# Altium schematic sheet Band_Pass.SchDoc
size 381 x 254 mm
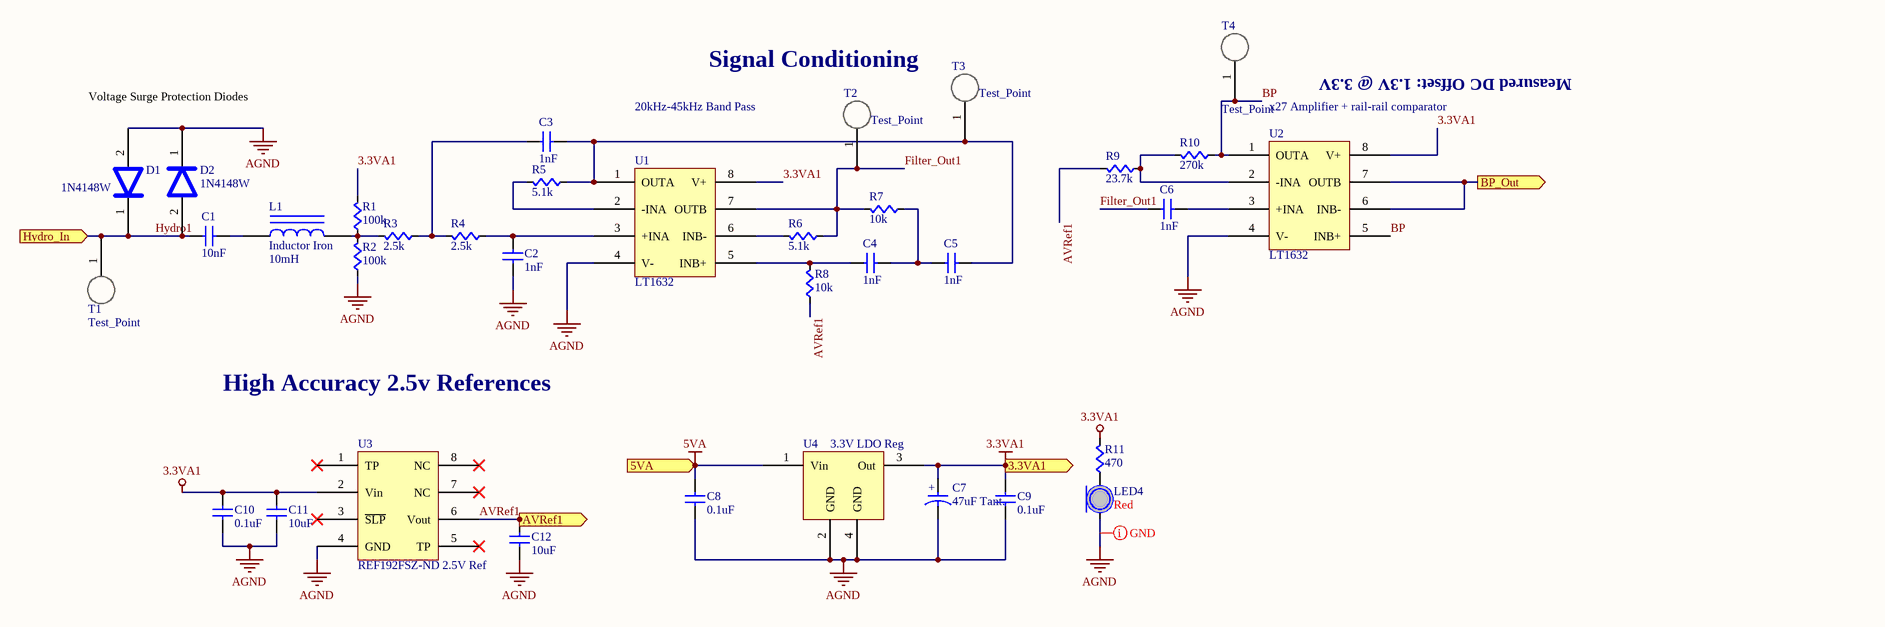
[diagram p0: Band_Pass.SchDoc]

## Parts
C1  value 10nF  [CAPC0603]  (hidden comment: Cap)
C2  value 1nF  [CAPC0603]  (hidden comment: Cap)
C3  value 1nF  [CAPC0603]  (hidden comment: Cap)
C4  value 1nF  [CAPC0603]  (hidden comment: Cap)
C5  value 1nF  [CAPC0603]  (hidden comment: Cap)
C6  value 1nF  [CAPC0603]  (hidden comment: Cap)
C7  value 47uF Tant.  [1206]  (hidden comment: Cap Tant)
C8  value 0.1uF  [CAPC0603]  (hidden comment: Cap)
C9  value 0.1uF  [CAPC0603]  (hidden comment: Cap)
C10  value 0.1uF  [CAPC0603]  (hidden comment: Cap)
C11  value 10uF  [CAPC0603]  (hidden comment: Cap)
C12  value 10uF  [CAPC0603]  (hidden comment: Cap)
D1  1N4148W  [SOD-123]
D2  1N4148W  [SOD-123]
L1  Inductor Iron  value 10mH  [Axial-11.7]
LED4  Color: Red  [LED0805]  (hidden comment: LED)
R1  value 100k  [RES0603]  (hidden comment: Res)
R2  value 100k  [RES0603]  (hidden comment: Res)
R3  value 2.5k  [RES0603]  (hidden comment: Res)
R4  value 2.5k  [RES0603]  (hidden comment: Res)
R5  value 5.1k  [RES0603]  (hidden comment: Res)
R6  value 5.1k  [RES0603]  (hidden comment: Res)
R7  value 10k  [RES0603]  (hidden comment: Res)
R8  value 10k  [RES0603]  (hidden comment: Res)
R9  value 23.7k  [RES0603]  (hidden comment: Res)
R10  value 270k  [RES0603]  (hidden comment: Res)
R11  value 470  [RES0603]  (hidden comment: Res)
T1  Test_Point  [TP]
T2  Test_Point  [TP]
T3  Test_Point  [TP]
T4  Test_Point  [TP]
U1  LT1632  [SOIC127P600-8N]
U2  LT1632  [SOIC127P600-8N]
U3  REF192FSZ-ND 2.5V Ref  [SOIC2.5-8n]
U4  3.3V LDO Reg  [SOT23-4n]

## Ports
3.3VA1 (out), 5VA (in), AVRef1 (out), BP_Out (out), Hydro_In (in)

## Nets
3.3VA1: C7.1(A) C9.1(A) C10.1(A) C11.1(A) R1.1(A) R11.1(A) U1.8(V+) U2.8(V+) U3.2(Vin) U4.3(Out) ; port 3.3VA1
5VA: C8.1(A) U4.1(Vin) ; port 5VA
AGND: C2.2(B) C7.2(B) C8.2(B) C9.2(B) C10.2(B) C11.2(B) C12.2(B) D1.2 D2.1 LED4.C R2.2(B) U1.4(V-) U2.4(V-) U3.4(GND) U4.2(GND) U4.4(GND)
AVRef1: C12.1(A) R8.2(B) R9.1(A) U3.6(Vout) ; port AVRef1
BP: R10.2(B) T4.1 U2.1(OUTA) U2.5(INB+)
BP_Out: U2.6(INB-) U2.7(OUTB) ; port BP_Out
Filter_Out1: C6.1(A) R6.2(B) R7.1(A) T2.1 U1.7(OUTB)
Hydro1: C1.1(A) D1.1 D2.2 T1.1 ; port Hydro_In
NetC1_2: C1.2(B) L1.1
NetC2_1: C2.1(A) R4.2(B) U1.3(+INA)
NetC3_1: C3.1(A) R3.2(B) R4.1(A)
NetC3_2: C3.2(B) C5.2(B) R5.2(B) T3.1 U1.1(OUTA)
NetC4_1: C4.1(A) R8.1(A) U1.5(INB+)
NetC4_2: C4.2(B) C5.1(A) R7.2(B)
NetC6_2: C6.2(B) U2.3(+INA)
NetL1_2: L1.2 R1.2(B) R2.1(A) R3.1(A)
NetLED4_A: LED4.A R11.2(B)
NetR5_1: R5.1(A) U1.2(-INA)
NetR6_1: R6.1(A) U1.6(INB-)
NetR9_2: R9.2(B) R10.1(A) U2.2(-INA)

Not connected (* = marked no-connect by the designer): U3 1(TP)* 3(~{SLP})* 5(TP)* 7(NC)* 8(NC)*

## Layout directives
net class Ground: AGND

## Notes on the sheet
- Voltage Surge Protection Diodes
- 20kHz-45kHz Band Pass
- Signal Conditioning
- x27 Amplifier + rail-rail comparator
- Measured DC Offset: 1.3V @ 3.3V
- High Accuracy 2.5v References
- (in symbol CapPol) +

## Library data of the parts
C7 = CapPol: CAP TANT 47UF 10V 10% 1411; Supplier 1: Digi-Key; Supplier Part Number 1: 399-9728-1-ND
D1 D2 = 1N4148W: DIODE GEN PURP 75V 150MA SOD123; Supplier 1: Digi-Key; Supplier Part Number 1: 1N4148W-E3-08CT-ND
L1 = Inductor Iron: Magnetic-Core Inductor; Published: 24-Mar-1999; LatestRevisionDate: 17-Jul-2002; LatestRevisionNote: Re-released for DXP Platform.; PackageReference: AXIAL-0.9; Publisher: Altium Limited; PackageDescription: Axial Device, Thru-Hole; 2 Leads; 0.9 in Pin Spacing; Supplier 1: Digi-Key; Supplier Part Number 1: RLB0812-103KL-ND
T1-T4 = Test_Point: TEST POINT PC COMPACT .063"D; Supplier 1: Digi-Key; Supplier Part Number 1: 5006K-ND
U1 U2 = LT1632: IC OPAMP GP 45MHZ RRO 8SO; Supplier 1: Digi-Key; Supplier Part Number 1: LT1632CS8#PBF-ND
U3 = Ref2.5V: IC VREF SERIES 2.5V 8SOIC; Supplier 1: Digi-Key; Supplier Part Number 1: REF192FSZ-ND
U4 = LM3940IMPX-3.3: IC REG LDO 3.3V 1A SOT223; Supplier 1: Digi-Key; Supplier Part Number 1: LM3940IMPX-3.3/NOPBCT-ND
C1-C6 C8-C12 = Cap: Supplier 1: Digi-Key; Supplier Part Number 1: 1276-1000-1-ND
LED4 = LED: Supplier 1: Digi-Key; Supplier Part Number 1: 754-1122-1-ND
R1-R11 = Res: Supplier 1: Digi-Key; Supplier Part Number 1: RMCF0603JT10K0CT-ND